# Altium schematic sheet PWM Signal Isolation.SchDoc
size A3; SheetNumber: 9; SheetTotal: 9
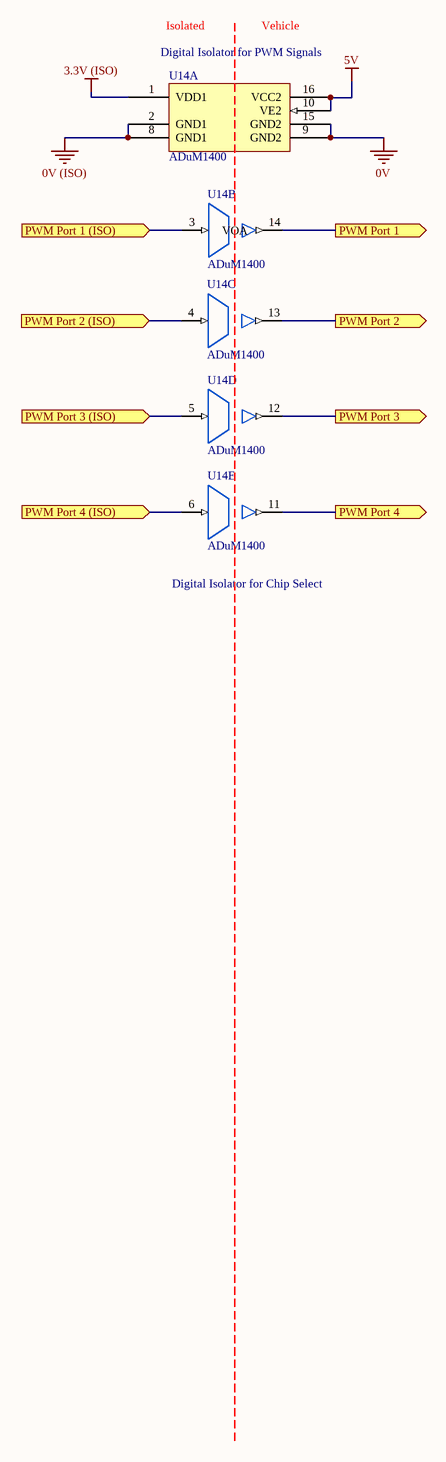
[diagram p0: PWM Signal Isolation.SchDoc]

## Parts
U14  ADuM1400  [AD 16-SOIC]  (parts A,B,C,D,E of 5)

## Ports
PWM Port 1 (ISO) (in), PWM Port 1 (out), PWM Port 2 (ISO) (in), PWM Port 2 (out), PWM Port 3 (ISO) (in), PWM Port 3 (out), PWM Port 4 (ISO) (in), PWM Port 4 (out)

## Nets
0V: U14.9(GND2) U14.15(GND2)
0V (ISO): U14.2(GND1) U14.8(GND1)
3.3V (ISO): U14.1(VDD1)
5V: U14.10(VE2) U14.16(VCC2)
PWM Port 1: U14.14(VOA) ; port PWM Port 1
PWM Port 1 (ISO): U14.3(VIA) ; port PWM Port 1 (ISO)
PWM Port 2: U14.13(VOB) ; port PWM Port 2
PWM Port 2 (ISO): U14.4(VIB) ; port PWM Port 2 (ISO)
PWM Port 3: U14.12(VOC) ; port PWM Port 3
PWM Port 3 (ISO): U14.5(VIC) ; port PWM Port 3 (ISO)
PWM Port 4: U14.11(VOD) ; port PWM Port 4
PWM Port 4 (ISO): U14.6(VID) ; port PWM Port 4 (ISO)

## Notes on the sheet
- (near U14) Digital Isolator for PWM Signals
- Isolated
- Vehicle
- Digital Isolator for Chip Select

## Library data of the parts
U14 = ADuM1400: General Purpose Digital Isolator 2500Vrms 4 Channel 1Mbps 25kV/µs CMTI 16-SOIC (0.295", 7.50mm Width); Manufacturer: Analog Devices; Part Number: ADuM1400; Digikey Part Number: ADUM1400WSRWZ-ND; Digikey Link: https://www.digikey.com/product-detail/en/analog-devices-inc/ADUM1400WSRWZ/ADUM1400WSRWZ-ND/1873713